# EAGLE design Jam (EAGLE 6.6.0)
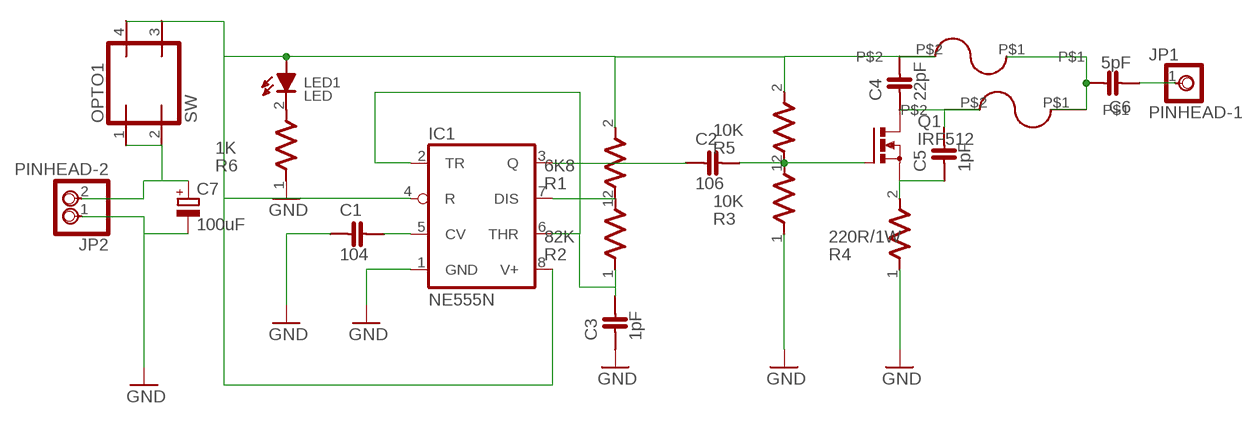
[diagram p0: schematic, sheet 1]

## Parts
2.2NH  L5  [L5]
C1  104  CAP-NP5  [CAP-NP5]
C2  106  CAP-NP5  [CAP-NP5]
C3  1pF  CAP-NP5  [CAP-NP5]
C4  22pF  CAP-NP5  [CAP-NP5]
C5  1pF  CAP-NP5  [CAP-NP5]
C6  5pF  CAP-NP5  [CAP-NP5]
C7  100uF  CPOL-EUE2.5-7  [E2,5-7]
IC1  NE555N  [DIL08]
JP1  PINHEAD-1  [PINHEAD-1]
JP2  PINHEAD-2  [PINHEAD-2]
LED1  LED  LED-5  [LED5]
OPTO1  SW  PC817  [DIL-04]
Q1  IRF512  [TO220BV]
R1  6K8  R-7,5  [R-7,5]
R2  82K  R-7,5  [R-7,5]
R3  10K  R-7,5  [R-7,5]
R4  220R/1W  R-10  [R-10]
R5  10K  R-7,5  [R-7,5]
R6  1K  R-7,5  [R-7,5]
U$1  L5  [L5]

## Nets
GND: C1.1 C3.1 C7.- IC1.1(GND) JP2.1 R3.1 R4.1 R6.1
N$1: C1.2 IC1.5(CV)
N$2: 2.2NH.P$2 C4.2 IC1.4(R) IC1.8(V+) LED1.A OPTO1.3(EMI) OPTO1.4(COL) R1.2 R5.2
N$3: C4.1 C5.2 Q1.D U$1.P$2
N$4: IC1.7(DIS) R1.1 R2.2
N$5: C3.2 IC1.2(TR) IC1.6(THR) R2.1
N$6: 2.2NH.P$1 C6.2 U$1.P$1
N$7: C2.1 IC1.3(Q)
N$8: C5.1 Q1.S R4.2
N$9: C2.2 Q1.G R3.2 R5.1
N$10: C6.1 JP1.1
N$11: C7.+ JP2.2 OPTO1.1(A) OPTO1.2(C)
N$12: LED1.K R6.2

## Library data of the parts
2.2NH U$1 = chuong:L5
C1-C6 = Lbr inverter sine:CAP-NP5
C7 = Lbr inverter sine:CPOL-EU: POLARIZED CAPACITOR, European symbol
IC1 = linear:*555: TIMER
JP1 = chuong:PINHEAD-1
JP2 = Lbr inverter sine:PINHEAD-2
LED1 = Lbr inverter sine:LED-5
OPTO1 = chuong:PC817
Q1 = Lbr inverter sine:IRF512: N-CHANNEL MOS FET
R1-R3 R5 R6 = Lbr inverter sine:R-7,5
R4 = Lbr inverter sine:R-10

## Board
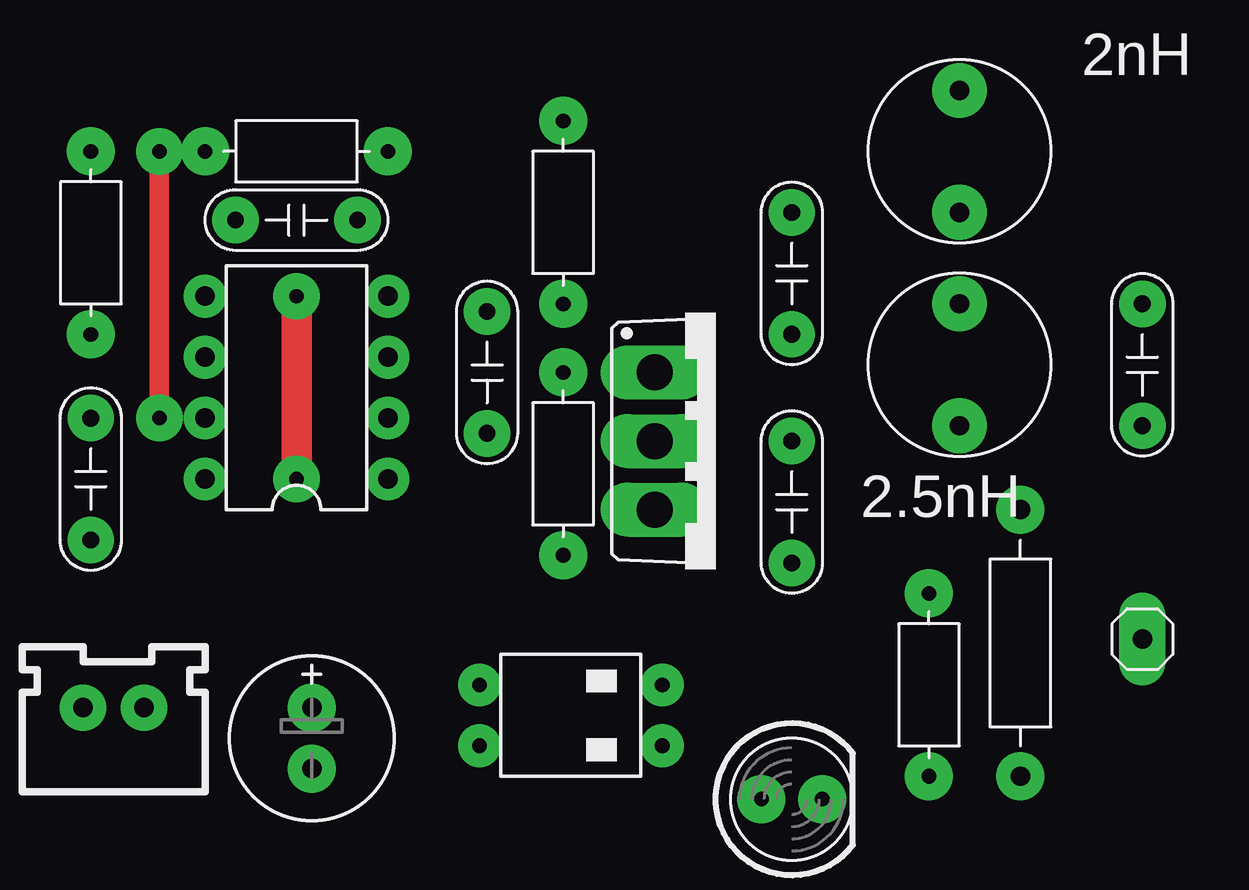
[diagram p1: board, top side]
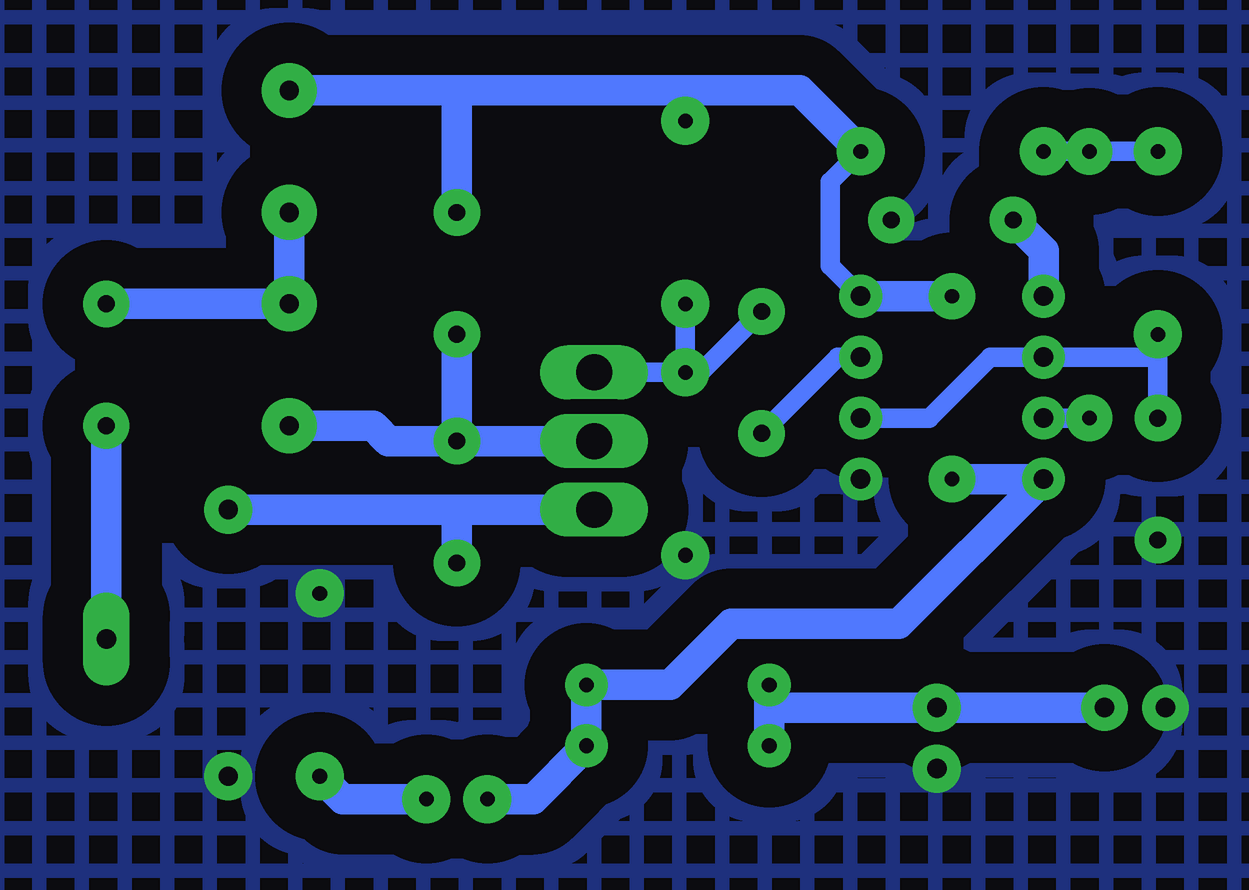
[diagram p2: board, bottom side, seen from below]

No outline drawn. Coordinates in mm, seen from the top.
Copper layers (1*16): Top 0.035mm / dielectric 1.5mm / Bottom 0.035mm
Design rules "default": minimum track width 10mil, minimum drill 24mil, track to track 8mil, track to pad 8mil, pad to pad 8mil, via to via 8mil, smd to smd 8mil, copper to edge 40mil, drill to drill 8mil, minimum pad ring 10mil, minimum via ring 8mil, stop-mask expansion 4mil, vias tented up to drill 0mil, thermal gap 10mil

### Footprints (pad centres in the part's own frame; a part is rotated, then mirrored left to right if it is on the bottom)
L5 = drill 0.8 pad 2.286: P$1 -6.35,0; P$2 -1.27,0
CAP-NP5 = drill 0.7 pad 1.93: 1 -2.54,0; 2 2.54,0
E2,5-7 = drill 0.813 pad 2: + -1.27,0; - 1.27,0
DIL08 = drill 0.813 pad 1.778: 1 -3.81,-3.81; 2 -1.27,-3.81; 3 1.27,-3.81; 4 3.81,-3.81; 5 3.81,3.81; 6 1.27,3.81; 7 -1.27,3.81; 8 -3.81,3.81
PINHEAD-1 = drill 0.813 pad 1.93 long: 1 -1.27,0
PINHEAD-2 = drill 0.813 pad 1.93: 1 -1.27,-0.318; 2 1.27,-0.318
LED5 = drill 0.61 pad 2: A -1.27,0; K 1.27,0
DIL-04 = drill 0.61 pad 1.778: 1 -1.27,-3.81; 2 1.27,-3.81; 3 1.27,3.81; 4 -1.27,3.81
TO220BV = drill 1.5 pad 2.184 long: D 0,-2.54; G -2.857,-2.54; S 2.857,-2.54
R-7,5 = drill 0.61 pad 2: 1 -3.81,0; 2 3.81,0
R-10 = drill 0.8 pad 2: 1 -5.715,0; 2 5.397,0

### Placement (x,y rotation side)
2.2NH  66.04,53.34 90 top
C1  38.42,46.67 180 top
C2  46.35,40.32 90 top
C3  29.84,35.88 90 top
C4  59.05,44.45 90 top
C5  59.05,34.92 90 top
C6  73.66,40.64 90 top
C7  39.05,25.08 270 top
IC1  38.42,39.69 90 top
JP1  74.93,29.21 0 top
JP2  30.8,26.67 0 top
LED1  59.05,22.54 0 top
OPTO1  49.85,26.04 270 top
Q1  55.88,37.47 270 top
R1  38.42,49.53 0 top
R2  29.84,45.72 90 top
R3  49.53,36.51 90 top
R4  68.58,29.21 90 top
R5  49.53,46.99 90 top
R6  64.77,27.3 270 top
U$1  66.04,36.83 270 top

### Tracks (layer width: path | path; a pad name or v marks a point on that pad's centre or on a via)
GND
  pour Bottom (isolate 1.676, no thermals, hatched): 19.05,62.55 82.87,62.55 82.87,12.38 19.05,12.38
N$1
  Bottom 1.27: IC1.5 34.61,45.4 C1.2
N$2  (via drill 0.6 pad 1.93)
  Top 1.27: v38.42,35.88 v38.42,43.5
  Bottom 0.813: R1.2 43.5,48.26 43.5,44.77 IC1.4
  Bottom 1.27: 2.2NH.P$2 59.37,52.07 | 59.37,52.07 49.53,52.07 | 49.53,52.07 44.77,52.07 R1.2 | R5.2 49.53,52.07 | C4.2 59.05,51.75 59.37,52.07 | v38.42,35.88 IC1.8 40.64,29.84 47.62,29.84 50.16,27.3 OPTO1.4 OPTO1.3 55.88,22.54 LED1.A | v38.42,43.5 IC1.4
N$3
  Bottom 1.27: Q1.D C5.2 | C5.2 61.91,37.47 62.55,38.1 U$1.P$2 | C4.1 C5.2
N$4  (via drill 0.6 pad 1.93)
  Top 0.813: v32.7,38.42 v32.7,49.53
  Bottom 0.813: R2.2 v32.7,49.53 R1.1 | IC1.7 v32.7,38.42
N$5
  Bottom 0.813: C3.2 29.84,40.96 | 29.84,40.96 R2.1 | 29.84,40.96 IC1.6 36.83,40.96 39.37,38.42 IC1.2
N$6
  Bottom 1.27: 2.2NH.P$1 U$1.P$1 C6.2
N$7
  Bottom 0.813: IC1.3 43.18,40.96 C2.1
N$8
  Bottom 1.27: Q1.S 58.74,34.61 | 58.74,34.61 R4.2 | C5.1 59.05,34.29 58.74,34.61
N$9
  Bottom 0.813: R3.2 48.9,40.32 C2.2 | R5.1 R3.2 | R3.2 Q1.G
N$10
  Bottom 1.27: C6.1 JP1.1
N$11
  Bottom 1.27: JP2.2 C7.+ 46.04,26.35 OPTO1.1 OPTO1.2
N$12
  Bottom 1.27: LED1.K 63.82,22.54 R6.2

### Text on the board
tPlace: 2nH | 2.5nH